# Altium schematic sheet STMH7.SchDoc
size A3
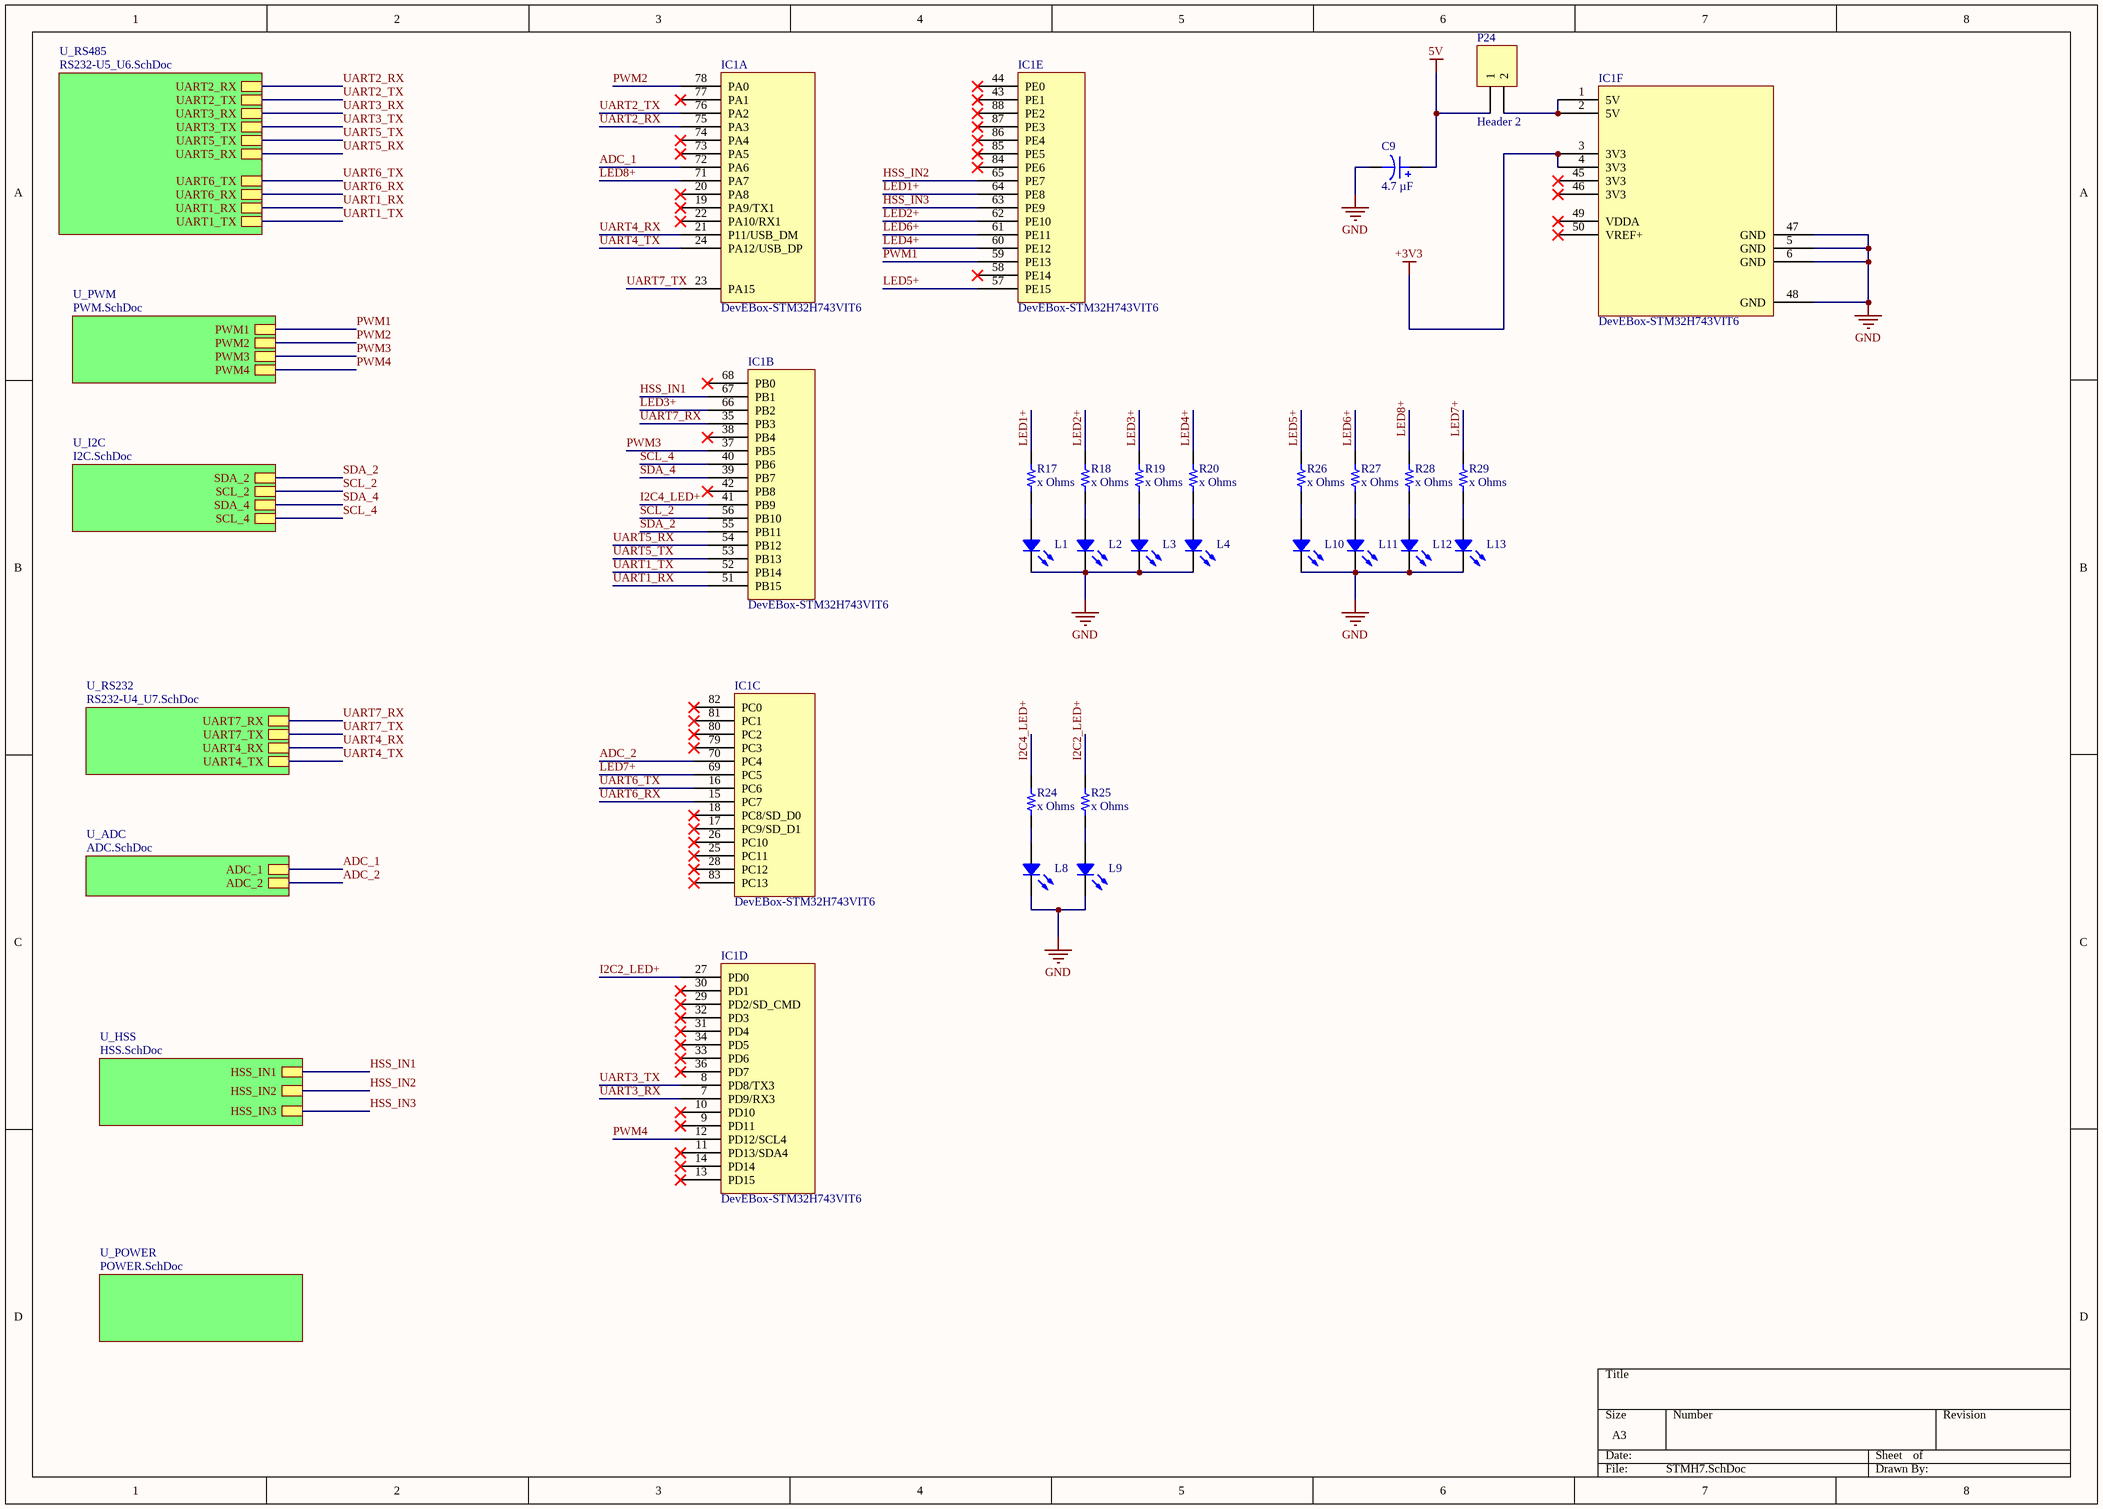
[diagram p0: STMH7.SchDoc]

## Parts
C9  4.7 µF  [CAP ALSMD 4.3MM H5.4MM]
IC1  DevEBox-STM32H743VIT6  [DevEBox-STM32H743VIT6]  (parts A,B,C,D,E,F of 6)
L1  LED_SMD  [LED_SMD]  (value not drawn)
L2  LED_SMD  [LED_SMD]  (value not drawn)
L3  LED_SMD  [LED_SMD]  (value not drawn)
L4  LED_SMD  [LED_SMD]  (value not drawn)
L8  LED_SMD  [LED_SMD]  (value not drawn)
L9  LED_SMD  [LED_SMD]  (value not drawn)
L10  LED_SMD  [LED_SMD]  (value not drawn)
L11  LED_SMD  [LED_SMD]  (value not drawn)
L12  LED_SMD  [LED_SMD]  (value not drawn)
L13  LED_SMD  [LED_SMD]  (value not drawn)
P24  Header 2  [HDR1X2]
R17  x Ohms  [RES 1206_3216 RF]
R18  x Ohms  [RES 1206_3216 RF]
R19  x Ohms  [RES 1206_3216 RF]
R20  x Ohms  [RES 1206_3216 RF]
R24  x Ohms  [RES 1206_3216 RF]
R25  x Ohms  [RES 1206_3216 RF]
R26  x Ohms  [RES 1206_3216 RF]
R27  x Ohms  [RES 1206_3216 RF]
R28  x Ohms  [RES 1206_3216 RF]
R29  x Ohms  [RES 1206_3216 RF]

## Sub-sheets
U_ADC = ADC.SchDoc: ADC_1, ADC_2
U_HSS = HSS.SchDoc: HSS_IN1, HSS_IN2, HSS_IN3
U_I2C = I2C.SchDoc: SDA_2, SCL_2, SDA_4, SCL_4
U_POWER = POWER.SchDoc: no entries
U_PWM = PWM.SchDoc: PWM1, PWM2, PWM4, PWM3
U_RS232 = RS232-U4_U7.SchDoc: UART7_RX, UART7_TX, UART4_RX, UART4_TX
U_RS485 = RS232-U5_U6.SchDoc: UART2_RX, UART2_TX, UART3_RX, UART3_TX, UART5_TX, UART5_RX, UART6_TX, UART6_RX, UART1_RX, UART1_TX

## Nets
5V: C9.1 P24.1
+3V3: IC1.3(3V3) IC1.4(3V3)
GND: C9.2 IC1.5(GND) IC1.6(GND) IC1.47(GND) IC1.48(GND) L1.2 L2.2 L3.2 L4.2 L8.2 L9.2 L10.2 L11.2 L12.2 L13.2
ADC_1: IC1.72(PA6) ; sheet U_ADC/ADC_1
ADC_2: IC1.70(PC4) ; sheet U_ADC/ADC_2
HSS_IN1: IC1.67(PB1) ; sheet U_HSS/HSS_IN1
HSS_IN2: IC1.65(PE7) ; sheet U_HSS/HSS_IN2
HSS_IN3: IC1.63(PE9) ; sheet U_HSS/HSS_IN3
I2C2_LED+: IC1.27(PD0) R25.2
I2C4_LED+: IC1.41(PB9) R24.2
LED1+: IC1.64(PE8) R17.2
LED2+: IC1.62(PE10) R18.2
LED3+: IC1.66(PB2) R19.2
LED4+: IC1.60(PE12) R20.2
LED5+: IC1.57(PE15) R26.2
LED6+: IC1.61(PE11) R27.2
LED7+: IC1.69(PC5) R29.2
LED8+: IC1.71(PA7) R28.2
PWM1: IC1.59(PE13) ; sheet U_PWM/PWM1
PWM2: IC1.78(PA0) ; sheet U_PWM/PWM2
PWM3: IC1.37(PB5) ; sheet U_PWM/PWM3
PWM4: IC1.12(PD12/SCL4) ; sheet U_PWM/PWM4
SCL_2: IC1.56(PB10) ; sheet U_I2C/SCL_2
SCL_4: IC1.40(PB6) ; sheet U_I2C/SCL_4
SDA_2: IC1.55(PB11) ; sheet U_I2C/SDA_2
SDA_4: IC1.39(PB7) ; sheet U_I2C/SDA_4
UART1_RX: IC1.51(PB15) ; sheet U_RS485/UART1_RX
UART1_TX: IC1.52(PB14) ; sheet U_RS485/UART1_TX
UART2_RX: IC1.75(PA3) ; sheet U_RS485/UART2_RX
UART2_TX: IC1.76(PA2) ; sheet U_RS485/UART2_TX
UART3_RX: IC1.7(PD9/RX3) ; sheet U_RS485/UART3_RX
UART3_TX: IC1.8(PD8/TX3) ; sheet U_RS485/UART3_TX
UART4_RX: IC1.21(P11/USB_DM) ; sheet U_RS232/UART4_RX
UART4_TX: IC1.24(PA12/USB_DP) ; sheet U_RS232/UART4_TX
UART5_RX: IC1.54(PB12) ; sheet U_RS485/UART5_RX
UART5_TX: IC1.53(PB13) ; sheet U_RS485/UART5_TX
UART6_RX: IC1.15(PC7) ; sheet U_RS485/UART6_RX
UART6_TX: IC1.16(PC6) ; sheet U_RS485/UART6_TX
UART7_RX: IC1.35(PB3) ; sheet U_RS232/UART7_RX
UART7_TX: IC1.23(PA15) ; sheet U_RS232/UART7_TX
NetIC1_1: IC1.1(5V) IC1.2(5V) P24.2
NetL1_1: L1.1 R17.1
NetL2_1: L2.1 R18.1
NetL3_1: L3.1 R19.1
NetL4_1: L4.1 R20.1
NetL8_1: L8.1 R24.1
NetL9_1: L9.1 R25.1
NetL10_1: L10.1 R26.1
NetL11_1: L11.1 R27.1
NetL12_1: L12.1 R28.1
NetL13_1: L13.1 R29.1

Not connected (* = marked no-connect by the designer): IC1 9(PD11)* 10(PD10)* 11(PD13/SDA4)* 13(PD15)* 14(PD14)* 17(PC9/SD_D1)* 18(PC8/SD_D0)* 19(PA9/TX1)* 20(PA8)* 22(PA10/RX1)* 25(PC11)* 26(PC10)* 28(PC12)* 29(PD2/SD_CMD)* 30(PD1)* 31(PD4)* 32(PD3)* 33(PD6)* 34(PD5)* 36(PD7)* 38(PB4)* 42(PB8)* 43(PE1)* 44(PE0)* 45(3V3)* 46(3V3)* 49(VDDA)* 50(VREF+)* 58(PE14)* 68(PB0)* 73(PA5)* 74(PA4)* 77(PA1)* 79(PC3)* 80(PC2)* 81(PC1)* 82(PC0)* 83(PC13)* 84(PE6)* 85(PE5)* 86(PE4)* 87(PE3)* 88(PE2)*

## Library data of the parts
C9 = EMVE350ADA4R7MD55G: CAP ALUM 4.7UF 20% 35V SMD; manufacturer: United Chemi-Con; Lifetime @ Temp.: 1000 Hrs @ 105°C; Polarization: Polar; Ripple Current @ Low Frequency: 16 mA @ 120 Hz; Surface Mount Land Size: 0.169" L x 0.169" W (4.30mm x 4.30mm); Part Number: EMVE350ADA4R7MD55G; Applications: General Purpose; Capacitance: 4.7 µF; componentlink1description: Datasheet; componentlink1url: //media.digikey.com/pdf/Data%20Sheets/United%20Chemi-Con%20PDFs/MVE%20Series.pdf; componentlink2description: DigiKey Link; componentlink2url: https://www.digikey.com/en/products/detail/united-chemi-con/EMVE350ADA4R7MD55G/756875; Device Package: Radial, Can - SMD; Height - Seated (Max): 0.205" (5.20mm); lastupdated: 15.03.2022 03:52:48; Lifecycle Status: Active; Minimum Order: 1; Mounting Type: Surface Mount; Operating Temperature: -40°C ~ 105°C; Package / Case: Radial, Can - SMD; packaging: TapeAndReel; partid: 7039; Part Status: Active; price: 0.09; series: Alchip™- MVE; Size / Dimension: 0.157" Dia (4.00mm); Supplier 1: DigiKey; Supplier Part Number 1: 565-2229-1-ND; Tolerance: ±20%; value: 4.7 µF; Voltage - Rated: 35 V
P24 = Header 2: Header, 2-Pin; LatestRevisionDate: 17-Jul-2002; LatestRevisionNote: Re-released for DXP Platform.; Publisher: Altium Limited
R17-R20 R24-R29 = RT1206BRD0749R9L: RES SMD 49.9 OHM 0.1% 1/4W 1206; Manufacturer: Yageo; Power (Watts): 0.25W, 1/4W; Resistance: 49.9 Ohms; Temperature Coefficient: ±25ppm/°C; Value: 49.9 Ohms; Part Number: RT1206BRD0749R9L; ComponentLink1Description: Datasheet; ComponentLink1URL: https://www.yageo.com/upload/media/product/productsearch/datasheet/rchip/PYu-RT_1-to-0.01_RoHS_L_11.pdf; ComponentLink2Description: DigiKey Link; ComponentLink2URL: https://www.digikey.com/en/products/detail/yageo/RT1206BRD0749R9L/1079849; Composition: Thin Film; Device Package: 1206 (3216 Metric); Height - Seated (Max): 0.026" (0.65mm); LastUpdated: 4.08.2022 05:00:43; Lifecycle Status: Active; Minimum Order: 1; Number of Terminations: 2; Operating Temperature: -55°C ~ 155°C; Package / Case: 1206 (3216 Metric); Packaging: TapeAndReel; PartId: 26863; Part Status: Active; Price: 0.10; Series: RT; Size / Dimension: 0.122" L x 0.063" W (3.10mm x 1.60mm); Supplier 1: DigiKey; Supplier Part Number 1: YAG5080CT-ND; Supplier Device Package: 1206; Tolerance: ±0.1%